# Altium project PCB_Project_T_1.PrjPcb
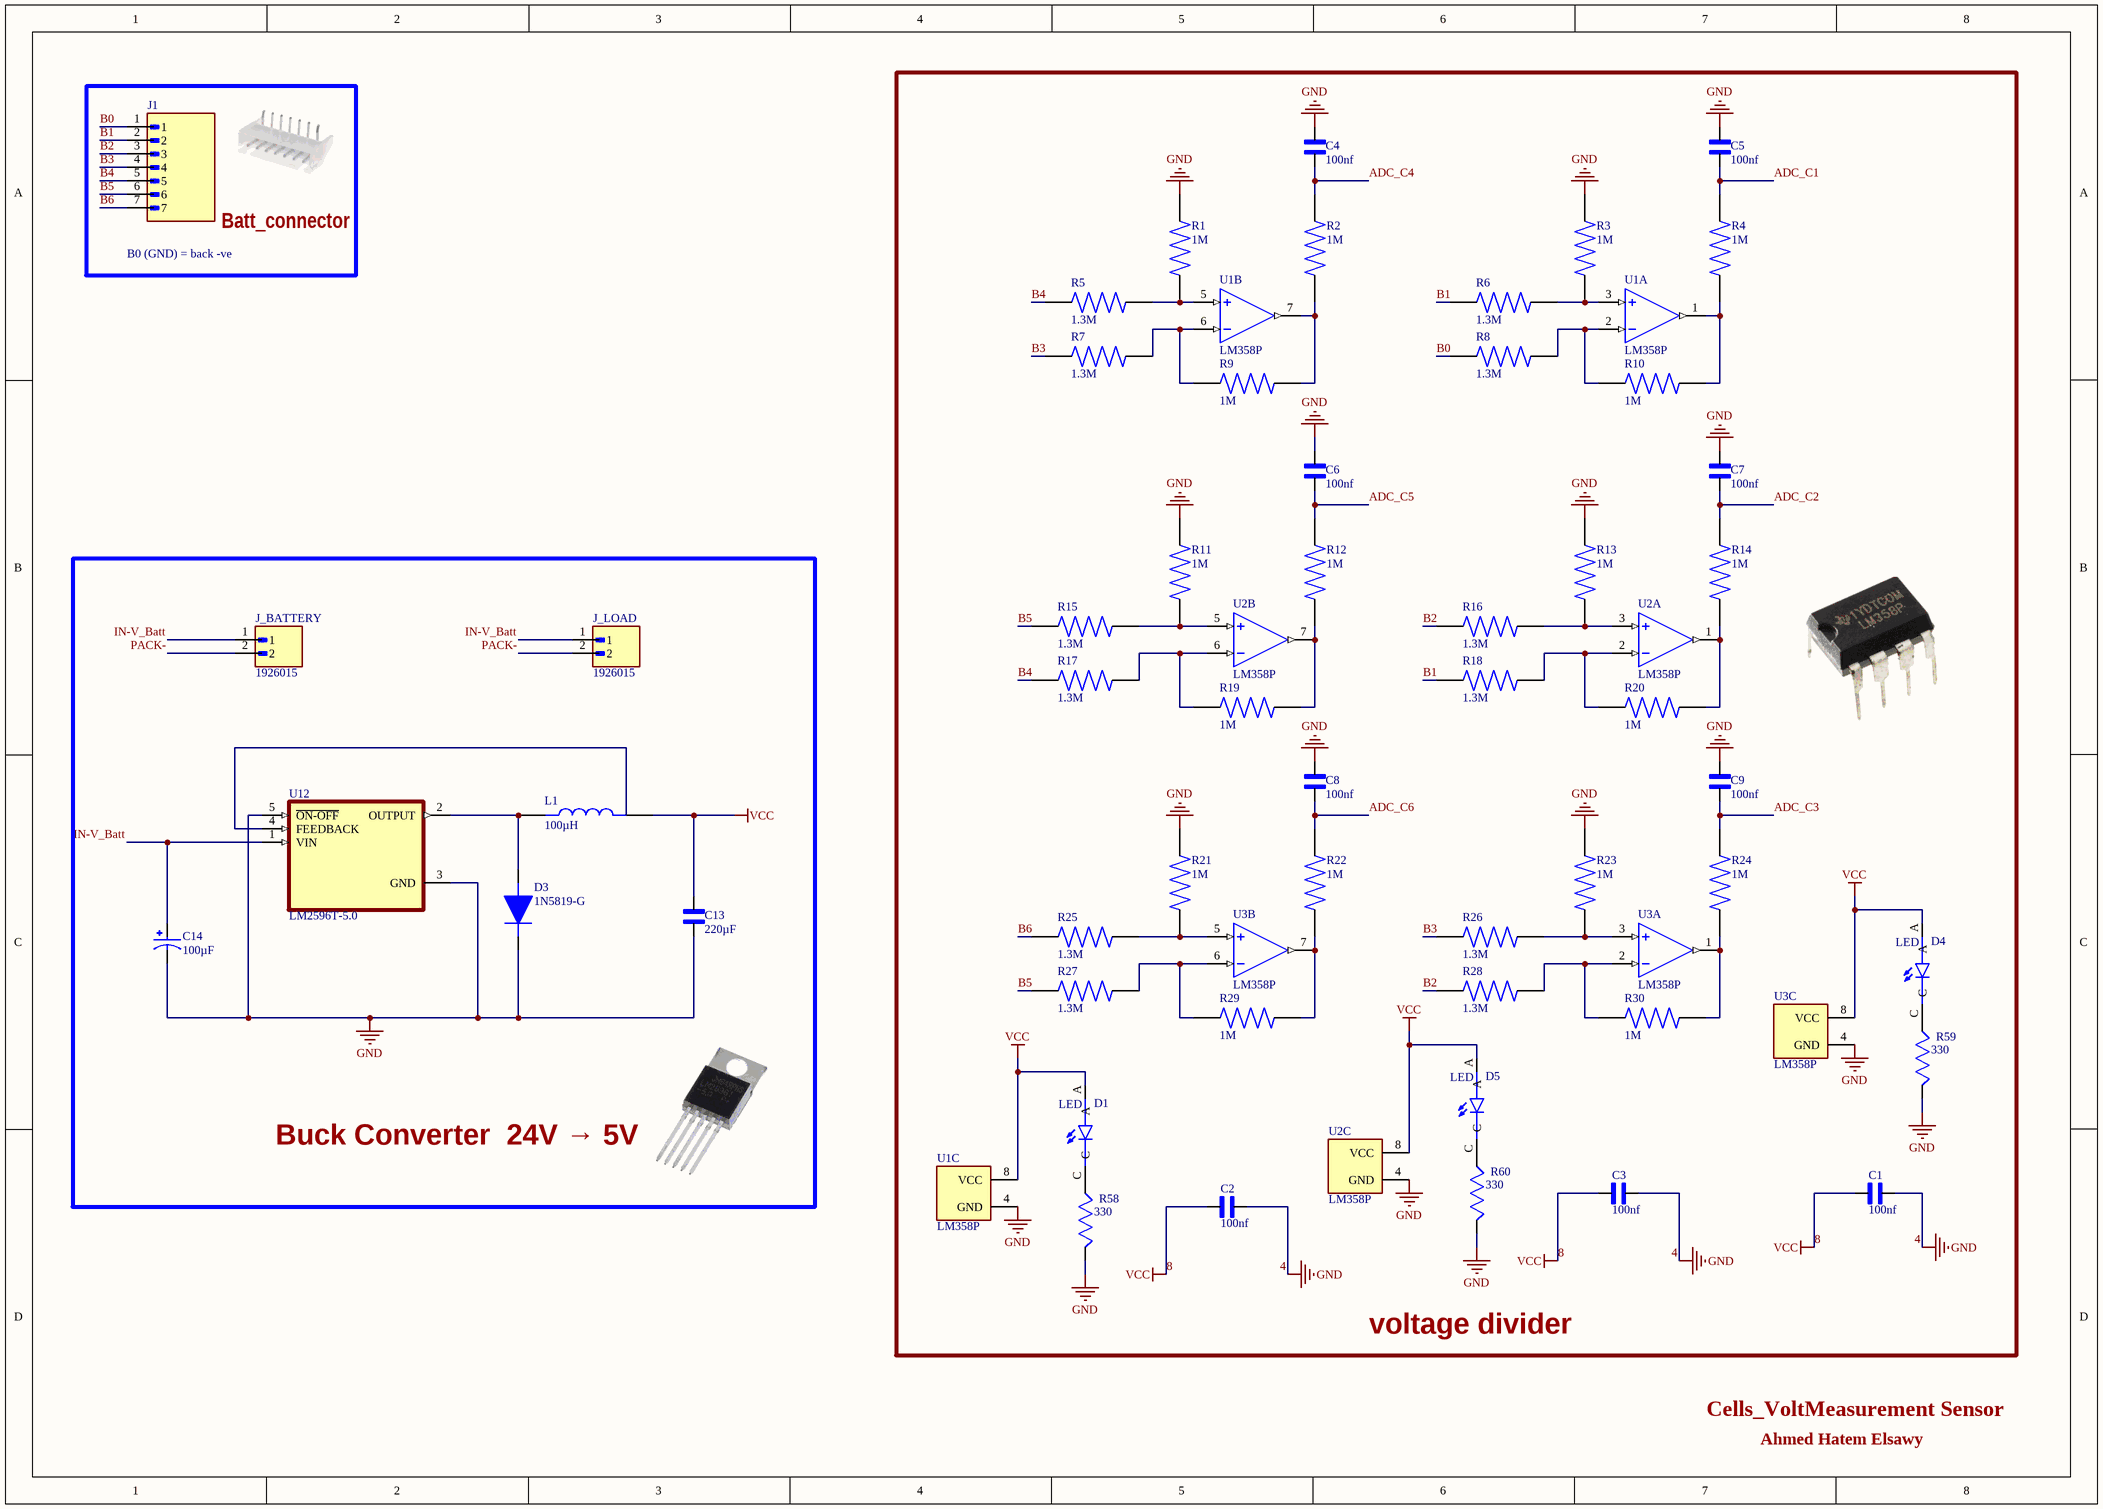
[diagram p0: CellsVoltMeasurementSensor.SchDoc]
4 sheets, 104 parts. Net scope: global (net labels, ports and power ports of the same name join across sheets).
Board file: PCB1.PcbDoc
Sheets:
  CellsVoltMeasurementSensor.SchDoc
  Passive Balancing.SchDoc
  PackVoltageCurrentSensor.SchDoc
  Controller.SchDoc

## Sheet CellsVoltMeasurementSensor.SchDoc
size A3; SheetNumber: 1; SheetTotal: 4

### Parts
C1  100nf  [CAPC1608X90N]
C2  100nf  [CAPC1608X90N]
C3  100nf  [CAPC1608X90N]
C4  100nf  [CAPC1608X90N]
C5  100nf  [CAPC1608X90N]
C6  100nf  [CAPC1608X90N]
C7  100nf  [CAPC1608X90N]
C8  100nf  [CAPC1608X90N]
C9  100nf  [CAPC1608X90N]
C13  220µF  [CAPPM7343X310N]
C14  100µF  [CAP_EEEFN1E101UP]
D1  LED  [LED_WP7113ID]
D3  1N5819-G  [DIOAD1405W75L465D235]
D4  LED  [LED_WP7113ID]
D5  LED  [LED_WP7113ID]
J1  S7B-XH-A(LF)(SN)  [JST_S7B-XH-A(LF)(SN)]  (value not drawn)
J_BATTERY  1926015  [PHOENIX_1926015]
J_LOAD  1926015  [PHOENIX_1926015]
L1  100µH  [INDC2012X145N]
R1  1M  [RESC3216X75N]
R2  1M  [RESC3216X75N]
R3  1M  [RESC3216X75N]
R4  1M  [RESC3216X75N]
R5  1.3M  [RESC5025X70N]
R6  1.3M  [RESC5025X70N]
R7  1.3M  [RESC5025X70N]
R8  1.3M  [RESC5025X70N]
R9  1M  [RESC3216X75N]
R10  1M  [RESC3216X75N]
R11  1M  [RESC3216X75N]
R12  1M  [RESC3216X75N]
R13  1M  [RESC3216X75N]
R14  1M  [RESC3216X75N]
R15  1.3M  [RESC5025X70N]
R16  1.3M  [RESC5025X70N]
R17  1.3M  [RESC5025X70N]
R18  1.3M  [RESC5025X70N]
R19  1M  [RESC3216X75N]
R20  1M  [RESC3216X75N]
R21  1M  [RESC3216X75N]
R22  1M  [RESC3216X75N]
R23  1M  [RESC3216X75N]
R24  1M  [RESC3216X75N]
R25  1.3M  [RESC5025X70N]
R26  1.3M  [RESC5025X70N]
R27  1.3M  [RESC5025X70N]
R28  1.3M  [RESC5025X70N]
R29  1M  [RESC3216X75N]
R30  1M  [RESC3216X75N]
R58  330  [RESC3216X65]
R59  330  [RESC3216X65]
R60  330  [RESC3216X65]
U1  LM358P  [DIP794W45P254L959H508Q8]  (parts A,B,C of 3)
U2  LM358P  [DIP794W45P254L959H508Q8]  (parts A,B,C of 3)
U3  LM358P  [DIP794W45P254L959H508Q8]  (parts A,B,C of 3)
U12  LM2596T-5.0  [TO170P1016X470X2092-5]

### Blocks framed on the sheet
Batt_connector: J1
voltage divider: C1-C9 D1 D4 D5 R1-R30 R58-R60 U1-U3
Buck Converter  24V → 5V: C13 C14 D3 J_BATTERY J_LOAD L1 U12

### Nets
4: C1.1 C2.1 C3.1 C4.2 C5.2 C6.2 C7.2 C8.2 C9.2 C13.1 C14.2 D3.1(K) R1.2 R3.2 R11.2 R13.2 R21.2 R23.2 R58.1 R59.1 R60.1 U1.4(GND) U2.4(GND) U3.4(GND) U12.3(GND) U12.5(~{ON-OFF})  [also labelled GND]
8: C1.2 C2.2 C3.2 C13.2 D1.A D4.A D5.A L1.2 U1.8(VCC) U2.8(VCC) U3.8(VCC)  [also labelled VCC]
ADC_C1: C5.1 R4.2
ADC_C2: C7.1 R14.2
ADC_C3: C9.1 R24.2
ADC_C4: C4.1 R2.2
ADC_C5: C6.1 R12.2
ADC_C6: C8.1 R22.2
B0: J1.1 R8.1
B1: J1.2 R6.1 R18.1
B2: J1.3 R16.1 R28.1
B3: J1.4 R7.1 R26.1
B4: J1.5 R5.1 R17.1
B5: J1.6 R15.1 R27.1
B6: J1.7 R25.1
IN-V_Batt: C14.1 J_BATTERY.1 J_LOAD.1 U12.1(VIN)
PACK-: J_BATTERY.2 J_LOAD.2
NetD1_C: D1.C R58.2
NetD3_2: D3.2(A) L1.1 U12.2(OUTPUT)
NetD4_C: D4.C R59.2
NetD5_C: D5.C R60.2
NetR1_1: R1.1 R5.2 U1.5(+IN2)
NetR2_1: R2.1 R9.2 U1.7(OUT2)
NetR3_1: R3.1 R6.2 U1.3(+IN1)
NetR4_1: R4.1 R10.2 U1.1(OUT1)
NetR7_2: R7.2 R9.1 U1.6(-IN2)
NetR8_2: R8.2 R10.1 U1.2(-IN1)
NetR11_1: R11.1 R15.2 U2.5(+IN2)
NetR12_1: R12.1 R19.2 U2.7(OUT2)
NetR13_1: R13.1 R16.2 U2.3(+IN1)
NetR14_1: R14.1 R20.2 U2.1(OUT1)
NetR17_2: R17.2 R19.1 U2.6(-IN2)
NetR18_2: R18.2 R20.1 U2.2(-IN1)
NetR21_1: R21.1 R25.2 U3.5(+IN2)
NetR22_1: R22.1 R29.2 U3.7(OUT2)
NetR23_1: R23.1 R26.2 U3.3(+IN1)
NetR24_1: R24.1 R30.2 U3.1(OUT1)
NetR27_2: R27.2 R29.1 U3.6(-IN2)
NetR28_2: R28.2 R30.1 U3.2(-IN1)

Not connected (* = marked no-connect by the designer): U12 4(FEEDBACK)

### Notes on the sheet
- (near J1) B0 (GND) = back -ve
- Cells_VoltMeasurement Sensor
- Ahmed Hatem Elsawy

### Library data of the parts
C1-C9 = 06035C104K4T2A: Capacitor MLCC 0603 100nF 50V | AVX 06035C104K4T2A; SnapEDA_Link: https://www.snapeda.com/parts/06035C104K4T2A/AVX/view-part/?ref=snap; Package: 1608 AVX; Value: *; MF: AVX; MP: 06035C104K4T2A; Check_prices: https://www.snapeda.com/parts/06035C104K4T2A/AVX/view-part/?ref=eda
C13 = 593D227X9010E2TE3: Capacitor;Tantalum;220uF;Tol 10%;SMT;Vol-Rtg 10V;Size 7343-43 | Sprague / Vishay 593D227X9010E2TE3; MF: Vishay Sprague; SnapEDA_Link: https://www.snapeda.com/parts/593D227X9010E2TE3/Vishay/view-part/?ref=snap; Package: 2917 Vishay; Value: *; MP: 593D227X9010E2TE3; Check_prices: https://www.snapeda.com/parts/593D227X9010E2TE3/Vishay/view-part/?ref=eda
C14 = EEEFN1E101UP: CAP ALUM 100UF 20% 25V SMD; MF: Panasonic; SnapEDA_Link: https://www.snapeda.com/parts/EEEFN1E101UP/Panasonic/view-part/?ref=snap; Package: RADIAL-2 Panasonic; Value: *; MP: EEEFN1E101UP; Check_prices: https://www.snapeda.com/parts/EEEFN1E101UP/Panasonic/view-part/?ref=eda
D1 D4 D5 = WP7113ID: Red 617nm LED Indication - Discrete 2V Radial; MF: Kingbright; Price: None; MP: WP7113ID; Package: Radial Kingbright; Check_prices: https://www.snapeda.com/parts/WP7113ID/Kingbright/view-part/?ref=eda; Purchase-URL: https://pricing.snapeda.com/search/part/WP7113ID/?ref=eda; Availability: In Stock; Value: *; SnapEDA_Link: https://www.snapeda.com/parts/WP7113ID/Kingbright/view-part/?ref=snap
D3 = 1N5819-G: Diode,Schottky Barrier,Vr 40V,If 1A,Pkg CASE 59-10,Vf 0.6V,Tj +125degc,Cs 25A | ON Semiconductor 1N5819G; SnapEDA_Link: https://www.snapeda.com/parts/1N5819G/Onsemi/view-part/?ref=snap; Package: DO-41 onsemi; Value: *; MF: ON Semiconductor; MP: 1N5819G; Check_prices: https://www.snapeda.com/parts/1N5819G/Onsemi/view-part/?ref=eda
J1 = S7B-XH-A(LF)(SN): Connector Header Through Hole, Right Angle 7 position 0.098 (2.50mm); MF: JST Sales; SnapEDA_Link: https://www.snapeda.com/parts/S7B-XH-A(LF)(SN)/JST/view-part/?ref=snap; Package: None; Value: *; MP: S7B-XH-A(LF)(SN); Check_prices: https://www.snapeda.com/parts/S7B-XH-A(LF)(SN)/JST/view-part/?ref=eda
L1 = MLF2012C101MTD25: 100ÂµH Shielded Multilayer Inductor 2mA 3.1Ohm Max 0805 (2012 Metric); MF: TDK; SnapEDA_Link: https://www.snapeda.com/parts/MLF2012C101MTD25/TDK/view-part/?ref=snap; Package: 0805 TDK Corporation; Value: *; MP: MLF2012C101MTD25; Check_prices: https://www.snapeda.com/parts/MLF2012C101MTD25/TDK/view-part/?ref=eda
R1-R4 R9-R14 R19-R24 R29 R30 = CR1206-FX-1004ELF: Res 1206 1M 1% 250mW | Bourns CR1206-FX-1004ELF; SnapEDA_Link: https://www.snapeda.com/parts/CR1206-FX-1004ELF/Bourns/view-part/?ref=snap; Package: 3216 Bourns; Value: *; MF: Bourns; MP: CR1206-FX-1004ELF; Check_prices: https://www.snapeda.com/parts/CR1206-FX-1004ELF/Bourns/view-part/?ref=eda
R5-R8 R15-R18 R25-R28 = ERJ-12ZYJ135U: Res Thick Film 2010 1.3M Ohm 5% 3/4W -400ppm/Â°C to 150ppm/Â°C Molded SMD SMD Embossed Carrier T/R; MF: Panasonic; SnapEDA_Link: https://www.snapeda.com/parts/ERJ-12ZYJ135U/Panasonic/view-part/?ref=snap; Package: 5025 Panasonic Electronic Components; Value: *; MP: ERJ-12ZYJ135U; Check_prices: https://www.snapeda.com/parts/ERJ-12ZYJ135U/Panasonic/view-part/?ref=eda
R58-R60 = RC1206JR-13330RL: Res Thick Film 1206 330 Ohm 5% 0.25W(1/4W) Â±100ppm/Â°C Epoxy Pad SMD T/R; MF: Yageo Corporation; MP: RC1206JR13330RL; SnapEDA_Link: https://www.snapeda.com/parts/RC1206JR13330RL/Yageo/view-part/?ref=snap; Package: 1206-2 YAGEO; Value: *; Check_prices: https://www.snapeda.com/parts/RC1206JR13330RL/Yageo/view-part/?ref=eda
U1-U3 = LM358P: Dual, 30-V, 700-kHz operational amplifier; MF: Texas Instruments; SnapEDA_Link: https://www.snapeda.com/parts/LM358P/Texas+Instruments/view-part/?ref=snap; Package: PDIP-8 Texas; Value: *; MP: LM358P; Check_prices: https://www.snapeda.com/parts/LM358P/Texas+Instruments/view-part/?ref=eda
U12 = LM2596T-5.0: SIMPLE SWITCHERÂ® 4.5V to 40V, 3A Low Component Count Step-Down Regulator 5-TO-220; MF: Texas Instruments; SnapEDA_Link: https://www.snapeda.com/parts/LM2596T-5.0/Texas+Instruments/view-part/?ref=snap; Package: TO-220-5 Texas Instruments; Value: *; MP: LM2596T-5.0; Check_prices: https://www.snapeda.com/parts/LM2596T-5.0/Texas+Instruments/view-part/?ref=eda
J_BATTERY J_LOAD = 1926015: Package: None; Price: None; Value: *; MP: 1926015; Availability: Unavailable

## Sheet Passive Balancing.SchDoc
size A3; SheetNumber: 2; SheetTotal: 3
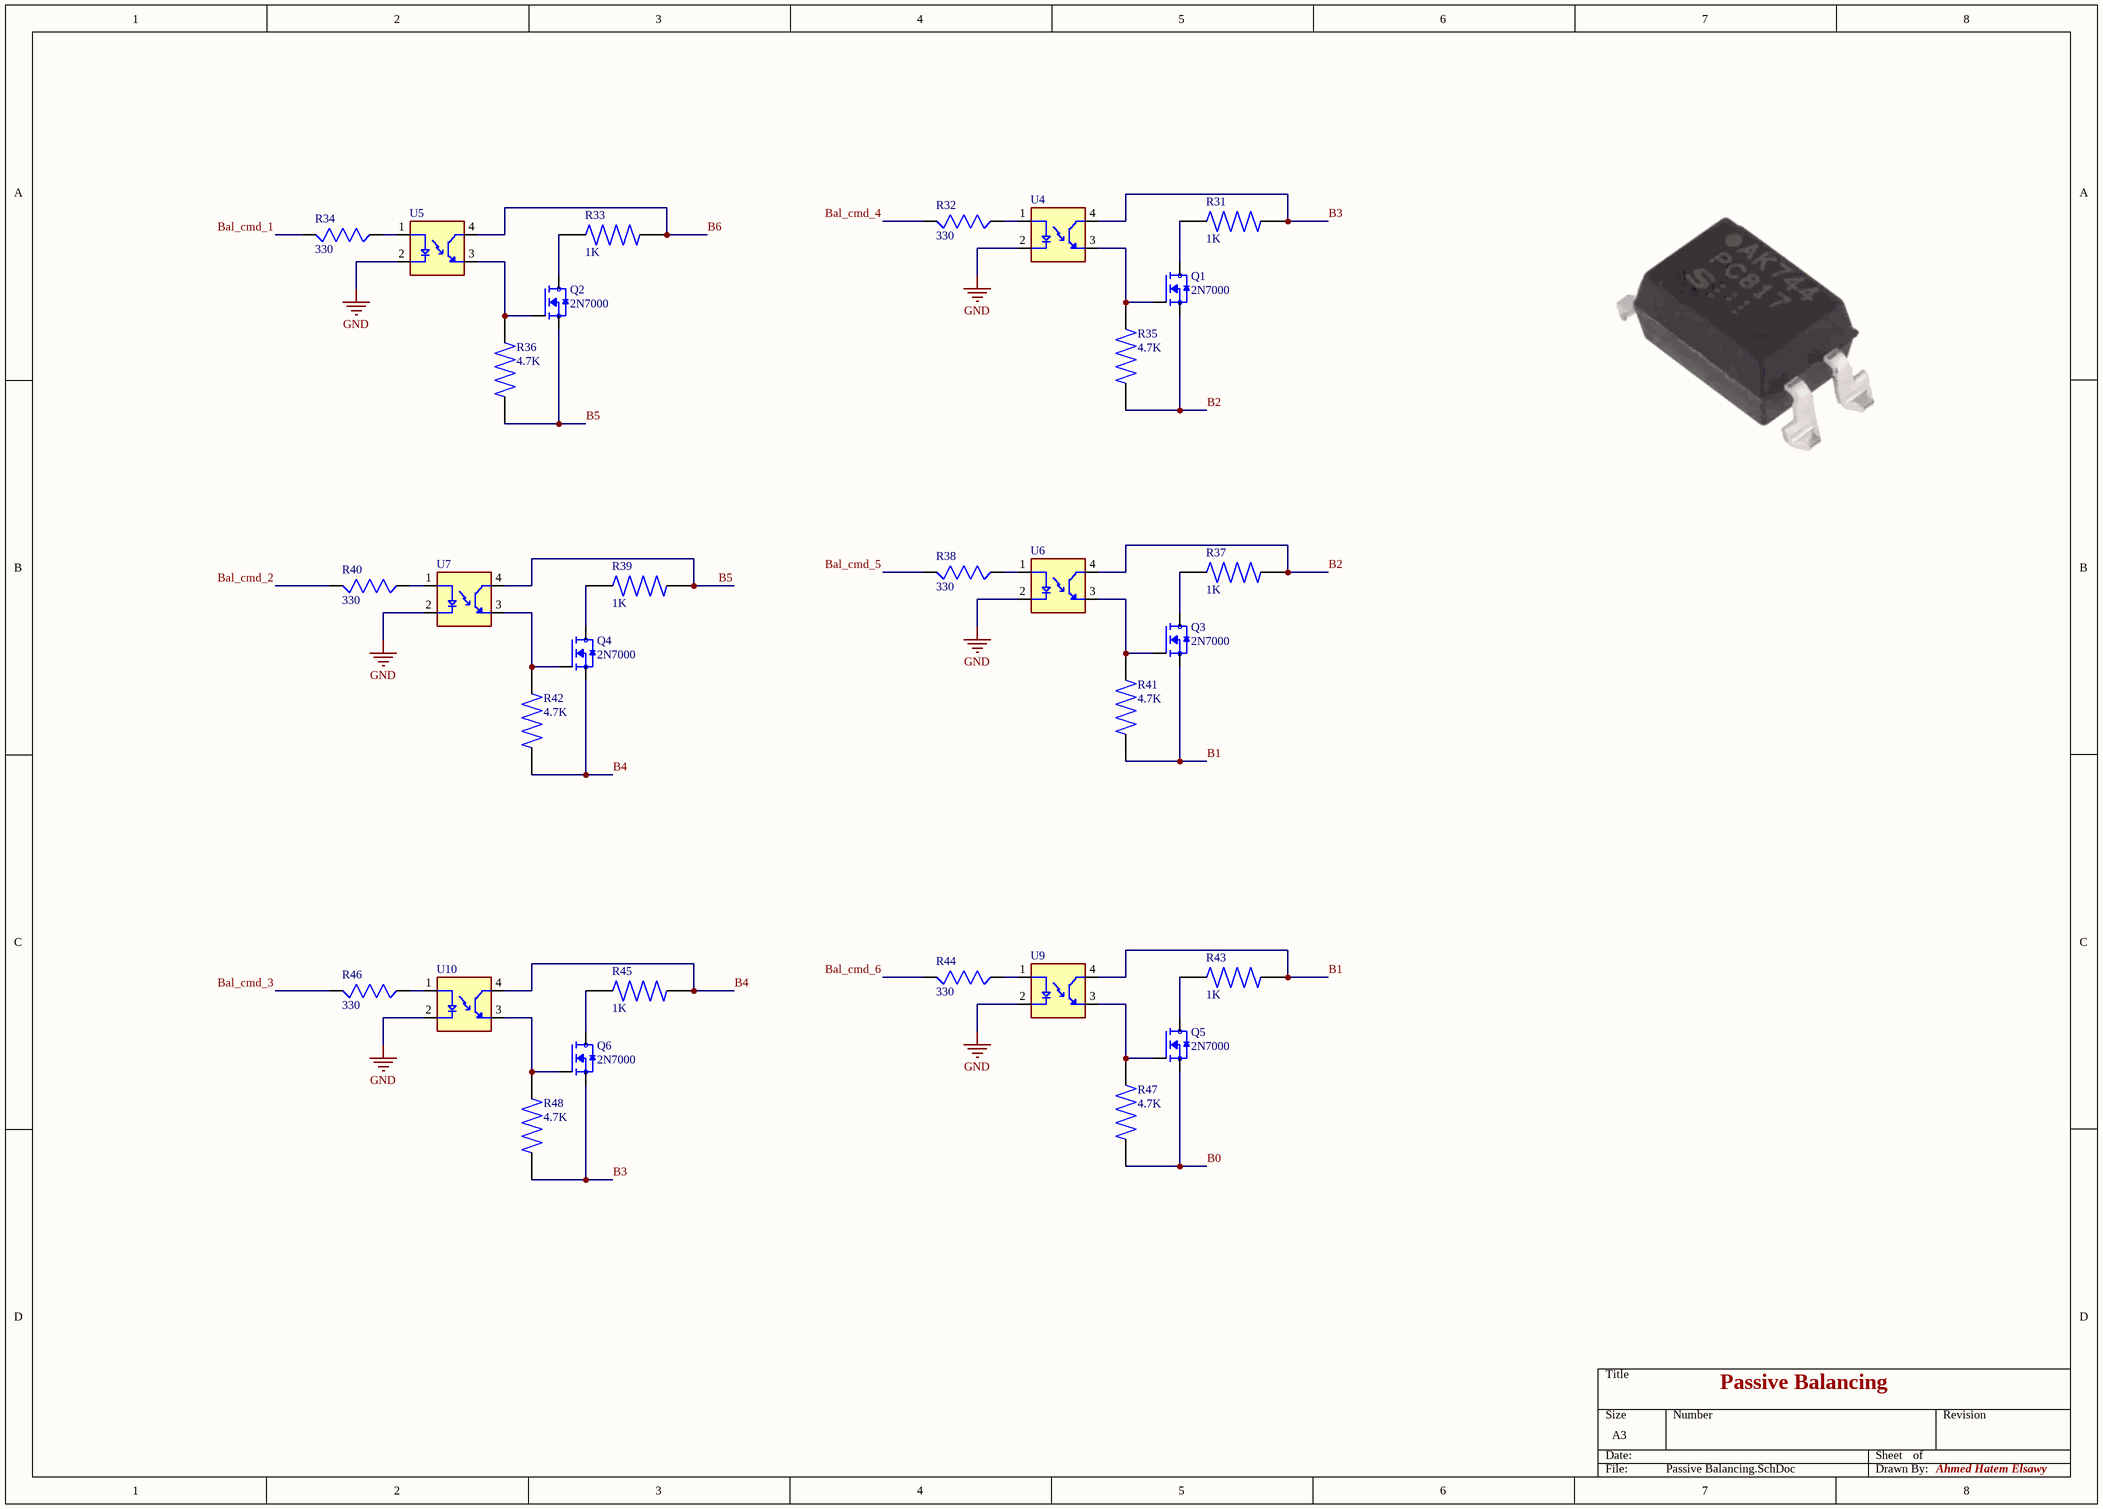
[diagram p1: Passive Balancing.SchDoc]

### Parts
Q1  2N7000  [TO92254P458H750-3]
Q2  2N7000  [TO92254P458H750-3]
Q3  2N7000  [TO92254P458H750-3]
Q4  2N7000  [TO92254P458H750-3]
Q5  2N7000  [TO92254P458H750-3]
Q6  2N7000  [TO92254P458H750-3]
R31  1K  [RESC1608X55N]
R32  330  [RESC3216X65]
R33  1K  [RESC1608X55N]
R34  330  [RESC3216X65]
R35  4.7K  [RES_ERJS06J472V]
R36  4.7K  [RES_ERJS06J472V]
R37  1K  [RESC1608X55N]
R38  330  [RESC3216X65]
R39  1K  [RESC1608X55N]
R40  330  [RESC3216X65]
R41  4.7K  [RES_ERJS06J472V]
R42  4.7K  [RES_ERJS06J472V]
R43  1K  [RESC1608X55N]
R44  330  [RESC3216X65]
R45  1K  [RESC1608X55N]
R46  330  [RESC3216X65]
R47  4.7K  [RES_ERJS06J472V]
R48  4.7K  [RES_ERJS06J472V]
U4  PC817X2NIP1B  [SOIC254P960X420-4N]  (value not drawn)
U5  PC817X2NIP1B  [SOIC254P960X420-4N]  (value not drawn)
U6  PC817X2NIP1B  [SOIC254P960X420-4N]  (value not drawn)
U7  PC817X2NIP1B  [SOIC254P960X420-4N]  (value not drawn)
U9  PC817X2NIP1B  [SOIC254P960X420-4N]  (value not drawn)
U10  PC817X2NIP1B  [SOIC254P960X420-4N]  (value not drawn)

### Nets
GND: U4.2(C) U5.2(C) U6.2(C) U7.2(C) U9.2(C) U10.2(C)  [project net 4]
B0: Q5.1(S) R47.1
B1: Q3.1(S) R41.1 R43.2 U9.4(CT)
B2: Q1.1(S) R35.1 R37.2 U6.4(CT)
B3: Q6.1(S) R31.2 R48.1 U4.4(CT)
B4: Q4.1(S) R42.1 R45.2 U10.4(CT)
B5: Q2.1(S) R36.1 R39.2 U7.4(CT)
B6: R33.2 U5.4(CT)
Bal_cmd_1: R34.1
Bal_cmd_2: R40.1
Bal_cmd_3: R46.1
Bal_cmd_4: R32.1
Bal_cmd_5: R38.1
Bal_cmd_6: R44.1
NetQ1_2: Q1.2(G) R35.2 U4.3(ET)
NetQ1_3: Q1.3(D) R31.1
NetQ2_2: Q2.2(G) R36.2 U5.3(ET)
NetQ2_3: Q2.3(D) R33.1
NetQ3_2: Q3.2(G) R41.2 U6.3(ET)
NetQ3_3: Q3.3(D) R37.1
NetQ4_2: Q4.2(G) R42.2 U7.3(ET)
NetQ4_3: Q4.3(D) R39.1
NetQ5_2: Q5.2(G) R47.2 U9.3(ET)
NetQ5_3: Q5.3(D) R43.1
NetQ6_2: Q6.2(G) R48.2 U10.3(ET)
NetQ6_3: Q6.3(D) R45.1
NetR32_2: R32.2 U4.1(A)
NetR34_2: R34.2 U5.1(A)
NetR38_2: R38.2 U6.1(A)
NetR40_2: R40.2 U7.1(A)
NetR44_2: R44.2 U9.1(A)
NetR46_2: R46.2 U10.1(A)

### Notes on the sheet
- Passive Balancing
- Ahmed Hatem Elsawy

### Library data of the parts
Q1-Q6 = 2N7000: N-Channel 60 V 350mA (Tc) 1W (Tc) Through Hole TO-92-3; MF: STMicroelectronics; SnapEDA_Link: https://www.snapeda.com/parts/2N7000/STMicroelectronics/view-part/?ref=snap; Package: Package; Value: *; MP: 2N7000; Check_prices: https://www.snapeda.com/parts/2N7000/STMicroelectronics/view-part/?ref=eda
R31 R33 R37 R39 R43 R45 = CR0603AFX-1001EAS: DirenÃ§, AS 0603 1k %1 100mW TC100 ¦ Bourns CR0603AFX-1001EAS; SnapEDA_Link: https://www.snapeda.com/parts/CR0603AFX-1001EAS/Bourns/view-part/?ref=snap; Package: 0603-2 Bourns; Value: *; MF: Bourns; MP: CR0603AFX-1001EAS; Check_prices: https://www.snapeda.com/parts/CR0603AFX-1001EAS/Bourns/view-part/?ref=eda
R32 R34 R38 R40 R44 R46 = RC1206JR-13330RL: as R58 on sheet CellsVoltMeasurementSensor; SnapEDA_Link: https://www.snapeda.com/parts/RC1206JR13330RL/Yageo/view-part/?ref=snap; Package: 1206-2 YAGEO; Value: *; Check_prices: https://www.snapeda.com/parts/RC1206JR13330RL/Yageo/view-part/?ref=eda
R35 R36 R41 R42 R47 R48 = ERJS06J472V: Price: None; Availability: Unavailable; MP: ERJS06J472V; Package: None; Value: *
U4-U7 U9 U10 = PC817X2NIP1B: Optocoupler DC-IN 1-CH Transistor DC-OUT 4-Pin DIP SMD T/R; MF: Sharp Microelectronics; SnapEDA_Link: https://www.snapeda.com/parts/PC817X2NIP1B/Sharp+Microelectronics/view-part/?ref=snap; Package: SMD-4 Sharp Microelectronics; Value: *; MP: PC817X2NIP1B; Check_prices: https://www.snapeda.com/parts/PC817X2NIP1B/Sharp+Microelectronics/view-part/?ref=eda

## Sheet PackVoltageCurrentSensor.SchDoc
size A; SheetNumber: 3; SheetTotal: 4
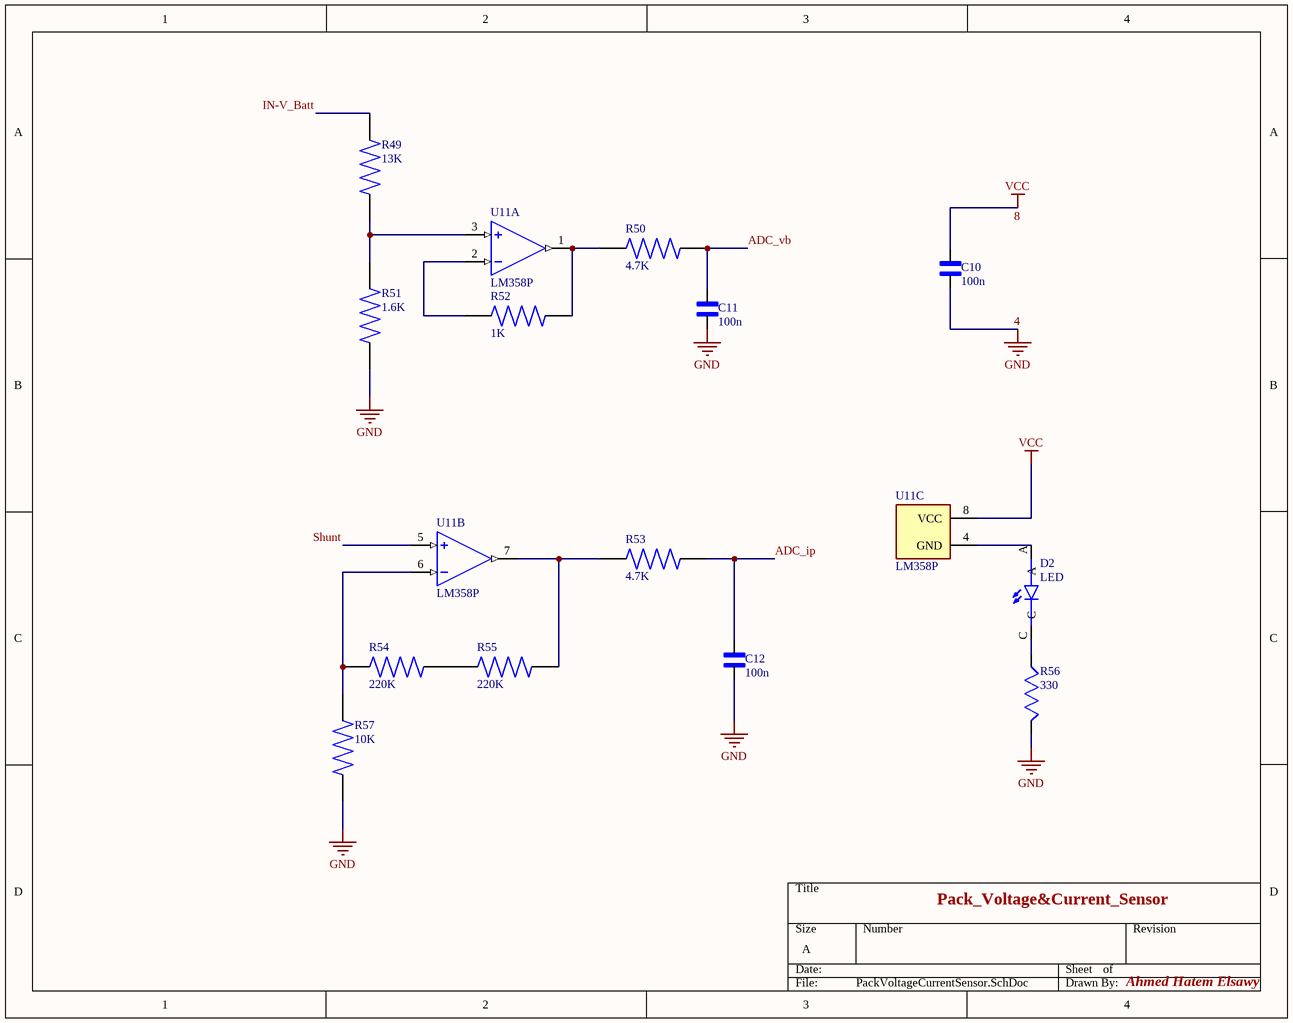
[diagram p2: PackVoltageCurrentSensor.SchDoc]

### Parts
C10  100n  [CAPC1608X90N]
C11  100n  [CAPC1608X90N]
C12  100n  [CAPC1608X90N]
D2  LED  [LED_WP7113ID]
R49  13K  [RES_ERJU03J133V]
R50  4.7K  [RES_ERJS06J472V]
R51  1.6K  [RES_ERA6ARB162V]
R52  1K  [RESC1608X55N]
R53  4.7K  [RES_ERJS06J472V]
R54  220K  [RES_ERJS06J224V]
R55  220K  [RES_ERJS06J224V]
R56  330  [RESC3216X65]
R57  10K  [RES_ERA8ARW103V]
U11  LM358P  [DIP794W45P254L959H508Q8]  (parts A,B,C of 3)

### Nets
4: C10.2 C11.2 C12.2 R51.1 R56.1 R57.1  [also labelled GND]
8: C10.1 U11.8(VCC)  [also labelled VCC]
ADC_ip: C12.1 R53.2
ADC_vb: C11.1 R50.2
IN-V_Batt: R49.2
Shunt: U11.5(+IN2)
NetD2_A: D2.A U11.4(GND)
NetD2_C: D2.C R56.2
NetR49_1: R49.1 R51.2 U11.3(+IN1)
NetR50_1: R50.1 R52.2 U11.1(OUT1)
NetR52_1: R52.1 U11.2(-IN1)
NetR53_1: R53.1 R55.2 U11.7(OUT2)
NetR54_1: R54.1 R57.2 U11.6(-IN2)
NetR54_2: R54.2 R55.1

### Notes on the sheet
- Pack_Voltage&Current_Sensor
- Ahmed Hatem Elsawy

### Library data of the parts
C10-C12 = 06035C104K4T2A: as C1 on sheet CellsVoltMeasurementSensor; SnapEDA_Link: https://www.snapeda.com/parts/06035C104K4T2A/AVX/view-part/?ref=snap; Package: 1608 AVX; Value: *; MF: AVX; MP: 06035C104K4T2A; Check_prices: https://www.snapeda.com/parts/06035C104K4T2A/AVX/view-part/?ref=eda
D2 = WP7113ID: as D1 on sheet CellsVoltMeasurementSensor; Price: None; MP: WP7113ID; Package: Radial Kingbright; Check_prices: https://www.snapeda.com/parts/WP7113ID/Kingbright/view-part/?ref=eda; Purchase-URL: https://pricing.snapeda.com/search/part/WP7113ID/?ref=eda; Availability: In Stock; Value: *; SnapEDA_Link: https://www.snapeda.com/parts/WP7113ID/Kingbright/view-part/?ref=snap
R49 = ERJU03J133V: RES 13K OHM 5% 1/10W 0603 SMD; MF: Panasonic; MP: ERJ-U03J133V; SnapEDA_Link: https://www.snapeda.com/parts/ERJ-U03J133V/Panasonic/view-part/?ref=snap; Package: 1608-2 Panasonic; Value: *; Check_prices: https://www.snapeda.com/parts/ERJ-U03J133V/Panasonic/view-part/?ref=eda
R50 R53 = ERJS06J472V: Price: None; Availability: Unavailable; MP: ERJS06J472V; Package: None; Value: *
R51 = ERA6ARB162V: MP: ERA6ARB162V; Availability: Unavailable; Value: *; Package: None; Price: None
R52 = CR0603AFX-1001EAS: as R31 on sheet Passive Balancing; SnapEDA_Link: https://www.snapeda.com/parts/CR0603AFX-1001EAS/Bourns/view-part/?ref=snap; Package: 0603-2 Bourns; Value: *; MF: Bourns; MP: CR0603AFX-1001EAS; Check_prices: https://www.snapeda.com/parts/CR0603AFX-1001EAS/Bourns/view-part/?ref=eda
R54 R55 = ERJS06J224V: Availability: Unavailable; Price: None; Value: *; MP: ERJS06J224V; Package: None
R56 = RC1206JR-13330RL: as R58 on sheet CellsVoltMeasurementSensor; SnapEDA_Link: https://www.snapeda.com/parts/RC1206JR13330RL/Yageo/view-part/?ref=snap; Package: 1206-2 YAGEO; Value: *; Check_prices: https://www.snapeda.com/parts/RC1206JR13330RL/Yageo/view-part/?ref=eda
R57 = ERA8ARW103V: MP: ERA8ARW103V; Availability: Unavailable; Package: None; Price: None; Value: *
U11 = LM358P: as U1 on sheet CellsVoltMeasurementSensor; SnapEDA_Link: https://www.snapeda.com/parts/LM358P/Texas+Instruments/view-part/?ref=snap; Package: PDIP-8 Texas; Value: *; MP: LM358P; Check_prices: https://www.snapeda.com/parts/LM358P/Texas+Instruments/view-part/?ref=eda

## Sheet Controller.SchDoc
size A4; SheetNumber: 3; SheetTotal: 3
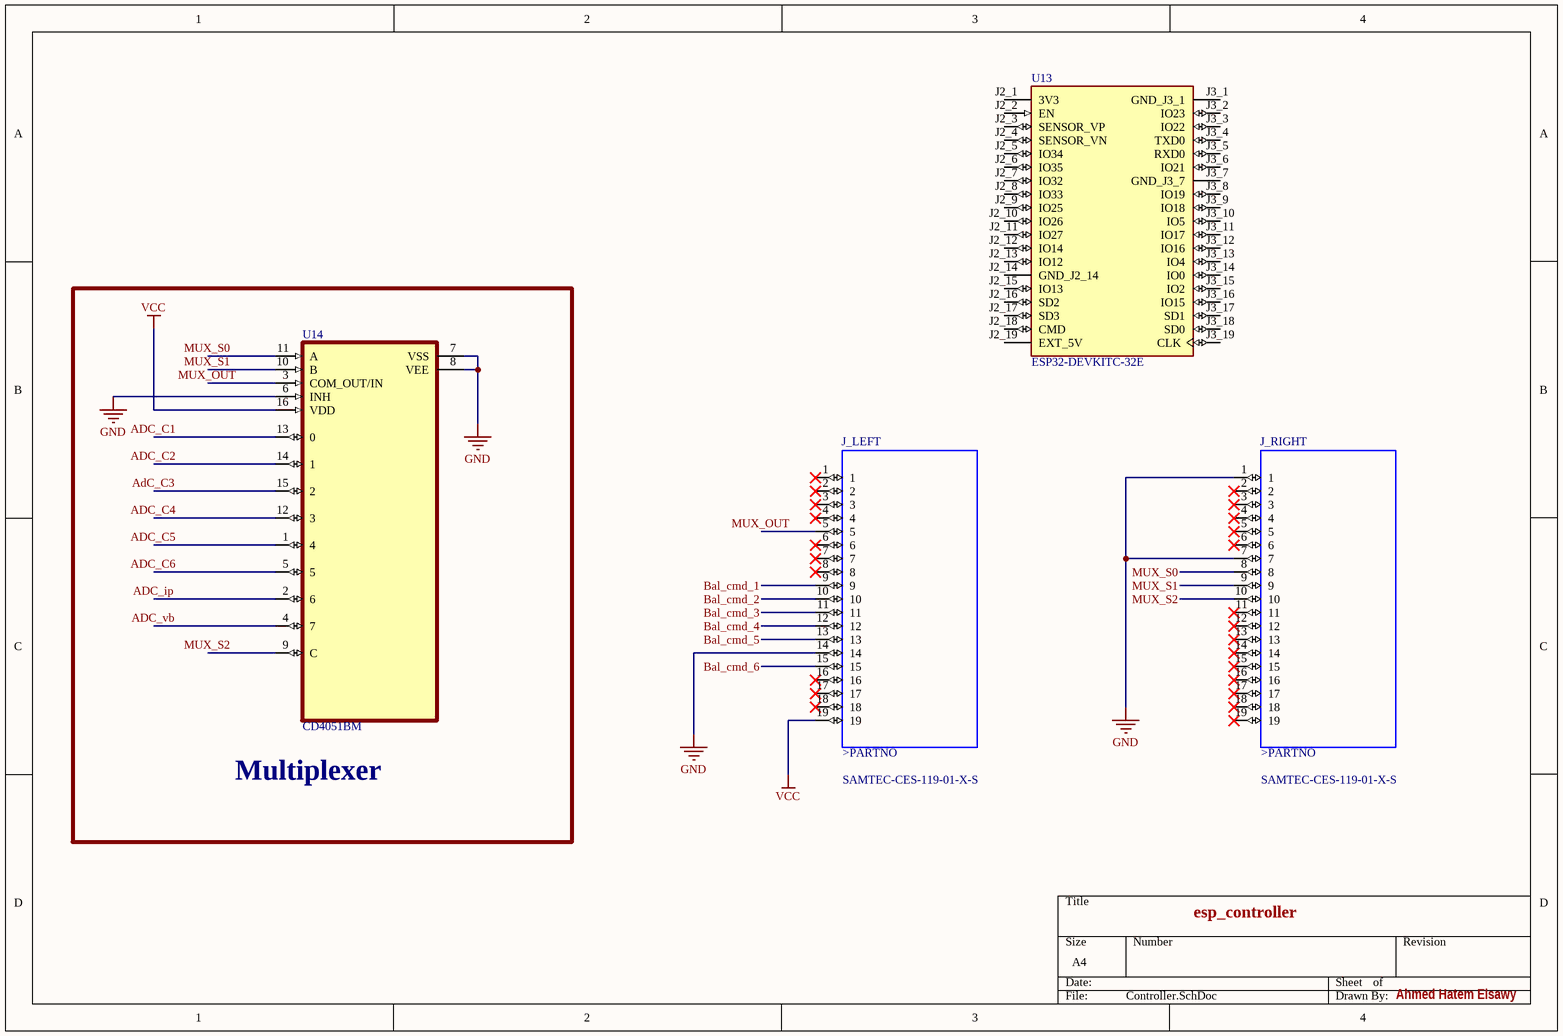
[diagram p3: Controller.SchDoc]

### Parts
J_LEFT  SAMTEC-CES-119-01-X-S  [SAMTEC-CES-119-01-X-S]  (value not drawn)
J_RIGHT  SAMTEC-CES-119-01-X-S  [SAMTEC-CES-119-01-X-S]  (value not drawn)
U13  ESP32-DEVKITC-32E  [MODULE_ESP32-DEVKITC-32E]
U14  CD4051BM  [SOIC127P600X175-16N]

### Blocks framed on the sheet
Multiplexer: U14

### Nets
GND: J_LEFT.14 J_RIGHT.1 J_RIGHT.7 U14.6(INH) U14.7(VSS) U14.8(VEE)  [project net 4]
VCC: J_LEFT.19 U14.16(VDD)  [project net 8]
ADC_C1: U14.13(0)
ADC_C2: U14.14(1)
ADC_C3: U14.15(2)
ADC_C4: U14.12(3)
ADC_C5: U14.1(4)
ADC_C6: U14.5
ADC_ip: U14.2(6)
ADC_vb: U14.4(7)
Bal_cmd_1: J_LEFT.9
Bal_cmd_2: J_LEFT.10
Bal_cmd_3: J_LEFT.11
Bal_cmd_4: J_LEFT.12
Bal_cmd_5: J_LEFT.13
Bal_cmd_6: J_LEFT.15
MUX_OUT: J_LEFT.5 U14.3(COM_OUT/IN)
MUX_S0: J_RIGHT.8 U14.11(A)
MUX_S1: J_RIGHT.9 U14.10(B)
MUX_S2: J_RIGHT.10 U14.9(C)

Not connected (* = marked no-connect by the designer): J_LEFT 1* 2* 3* 4* 6* 7* 8* 16* 17* 18*; J_RIGHT 2* 3* 4* 5* 6* 11* 12* 13* 14* 15* 16* 17* 18* 19*; U13 J2_1(3V3) J2_2(EN) J2_3(SENSOR_VP) J2_4(SENSOR_VN) J2_5(IO34) J2_6(IO35) J2_7(IO32) J2_8(IO33) J2_9(IO25) J2_10(IO26) J2_11(IO27) J2_12(IO14) J2_13(IO12) J2_14(GND_J2_14) J2_15(IO13) J2_16(SD2) J2_17(SD3) J2_18(CMD) J2_19(EXT_5V) J3_1(GND_J3_1) J3_2(IO23) J3_3(IO22) J3_4(TXD0) J3_5(RXD0) J3_6(IO21) J3_7(GND_J3_7) J3_8(IO19) J3_9(IO18) J3_10(IO5) J3_11(IO17) J3_12(IO16) J3_13(IO4) J3_14(IO0) J3_15(IO2) J3_16(IO15) J3_17(SD1) J3_18(SD0) J3_19(CLK)

### Notes on the sheet
- esp_controller
- Ahmed Hatem Elsawy
- (in symbol SAMTEC-CES-119-01-X-S) >PARTNO

### Library data of the parts
U13 = ESP32-DEVKITC-32E: The ESP32-DEVKITC-32E transceiver evaluation board from Espressif Systems is a powerful development tool for wireless communication technologies. It supports 802.11 b/g/n Wi-Fi and BluetoothÂ® Smart Ready 4.x (BLE) dual-mode at 2.4GHz, making it ideal for; SnapEDA_Link: https://www.snapeda.com/parts/ESP32-DEVKITC-32E/Espressif+Systems/view-part/?ref=snap; Package: None; Value: *; MF: Espressif Systems; MP: ESP32-DEVKITC-32E; Check_prices: https://www.snapeda.com/parts/ESP32-DEVKITC-32E/Espressif+Systems/view-part/?ref=eda
U14 = CD4051BM: 20-V, 8:1, 1-channel analog multiplexer with logic-level conversion; MF: Texas Instruments; SnapEDA_Link: https://www.snapeda.com/parts/CD4051BM/Texas+Instruments/view-part/?ref=snap; Package: SOIC-16 Texas Instruments; Value: *; MP: CD4051BM; Check_prices: https://www.snapeda.com/parts/CD4051BM/Texas+Instruments/view-part/?ref=eda
J_LEFT J_RIGHT = SAMTEC-CES-119-01-X-S: Package: None; Price: None; Value: *; MP: SAMTEC-CES-119-01-X-S; Availability: Unavailable

## Nets that join several sheets
4: CellsVoltMeasurementSensor (26 pins), Passive Balancing (6 pins), PackVoltageCurrentSensor (6 pins), Controller (6 pins)
8: CellsVoltMeasurementSensor (11 pins), PackVoltageCurrentSensor (C10.1 U11.8), Controller (J_LEFT.19 U14.16)
ADC_C1: CellsVoltMeasurementSensor (C5.1 R4.2), Controller (U14.13)
ADC_C2: CellsVoltMeasurementSensor (C7.1 R14.2), Controller (U14.14)
ADC_C3: CellsVoltMeasurementSensor (C9.1 R24.2), Controller (U14.15)
ADC_C4: CellsVoltMeasurementSensor (C4.1 R2.2), Controller (U14.12)
ADC_C5: CellsVoltMeasurementSensor (C6.1 R12.2), Controller (U14.1)
ADC_C6: CellsVoltMeasurementSensor (C8.1 R22.2), Controller (U14.5)
ADC_ip: PackVoltageCurrentSensor (C12.1 R53.2), Controller (U14.2)
ADC_vb: PackVoltageCurrentSensor (C11.1 R50.2), Controller (U14.4)
B0: CellsVoltMeasurementSensor (J1.1 R8.1), Passive Balancing (Q5.1 R47.1)
B1: CellsVoltMeasurementSensor (J1.2 R6.1 R18.1), Passive Balancing (Q3.1 R41.1 R43.2 U9.4)
B2: CellsVoltMeasurementSensor (J1.3 R16.1 R28.1), Passive Balancing (Q1.1 R35.1 R37.2 U6.4)
B3: CellsVoltMeasurementSensor (J1.4 R7.1 R26.1), Passive Balancing (Q6.1 R31.2 R48.1 U4.4)
B4: CellsVoltMeasurementSensor (J1.5 R5.1 R17.1), Passive Balancing (Q4.1 R42.1 R45.2 U10.4)
B5: CellsVoltMeasurementSensor (J1.6 R15.1 R27.1), Passive Balancing (Q2.1 R36.1 R39.2 U7.4)
B6: CellsVoltMeasurementSensor (J1.7 R25.1), Passive Balancing (R33.2 U5.4)
Bal_cmd_1: Passive Balancing (R34.1), Controller (J_LEFT.9)
Bal_cmd_2: Passive Balancing (R40.1), Controller (J_LEFT.10)
Bal_cmd_3: Passive Balancing (R46.1), Controller (J_LEFT.11)
Bal_cmd_4: Passive Balancing (R32.1), Controller (J_LEFT.12)
Bal_cmd_5: Passive Balancing (R38.1), Controller (J_LEFT.13)
Bal_cmd_6: Passive Balancing (R44.1), Controller (J_LEFT.15)
IN-V_Batt: CellsVoltMeasurementSensor (C14.1 J_BATTERY.1 J_LOAD.1 U12.1), PackVoltageCurrentSensor (R49.2)